# Altium schematic sheet WT2_Power.SchDoc
size A4
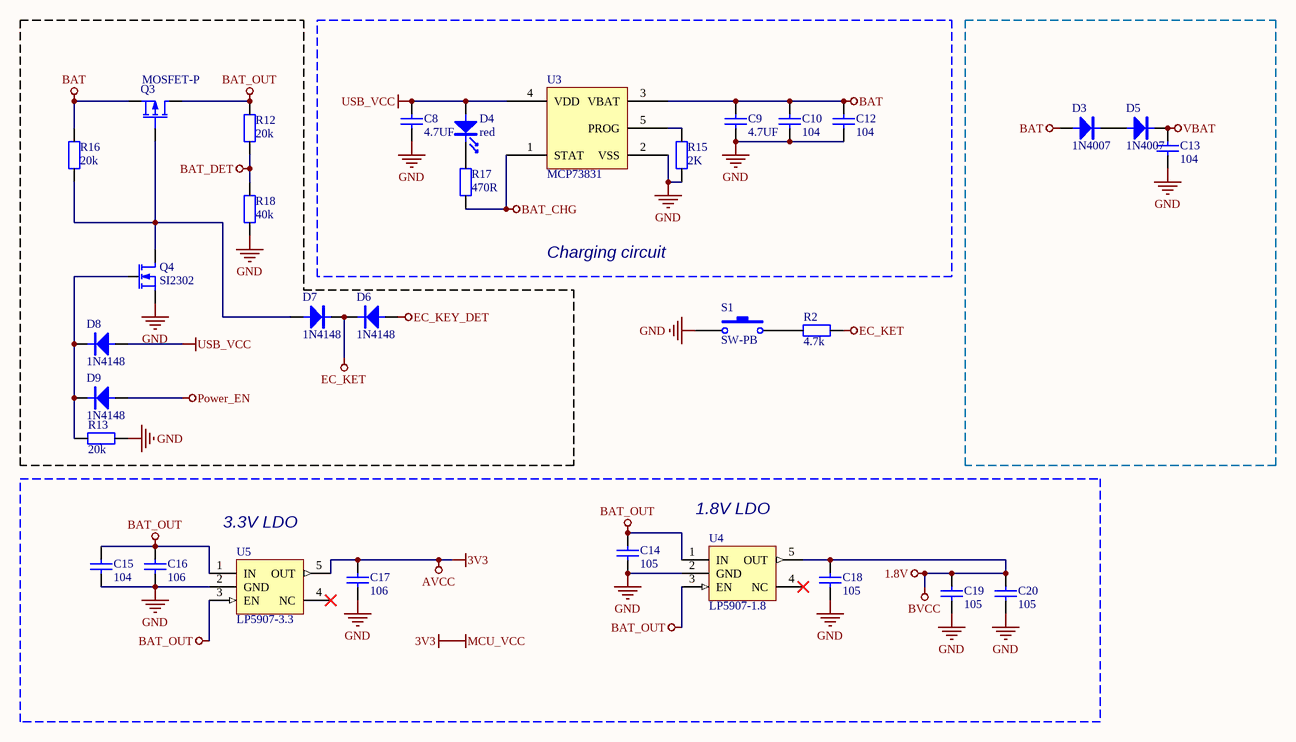
[diagram p0: WT2_Power.SchDoc]

## Parts
C8  4.7UF  [电容_C0805]
C9  4.7UF  [电容_C0805]
C10  104  [电容_C0402]
C12  104  [电容_C0402]
C13  104  [电容_C0402]
C14  105  [电容_C0402]
C15  104  [电容_C0402]
C16  106  [电容_C0603]
C17  106  [电容_C0603]
C18  105  [电容_C0402]
C19  105  [电容_C0402]
C20  105  [电容_C0402]
D3  1N4007  [二极管_SOD-323]
D4  red  [LED_0603]
D5  1N4007  [二极管_SOD-323]
D6  1N4148  [二极管_SOD-323]
D7  1N4148  [二极管_SOD-323]
D8  1N4148  [二极管_SOD-323]
D9  1N4148  [二极管_SOD-323]
Q3  MOSFET-P  [SOT23]
Q4  SI2302  [MOS_SOT-23]
R2  4.7k  [电阻_R0402]
R12  20k  [电阻_R0402]
R13  20k  [电阻_R0402]
R15  2K  [电阻_R0402]
R16  20k  [电阻_R0402]
R17  470R  [电阻_R0402]
R18  40k  [电阻_R0402]
S1  SW-PB  [KEY-TE26EA]
U3  MCP73831  [SOT23-5]
U4  LP5907-1.8  [SOT23-5]
U5  LP5907-3.3  [SOT23-5]

## Blocks framed on the sheet
Charging circuit: C8-C10 C12 D4 R15 R17 U3

## Nets
1.8V: C18.2 C19.2 C20.2 U4.5(OUT)  [also labelled BVCC]
3V3: C17.2 U5.5(OUT)  [also labelled AVCC, MCU_VCC]
BAT: C9.2 C10.1 C12.1 D3.A Q3.3(S) R16.2 U3.3(VBAT)
BAT_CHG: R17.1 U3.1(STAT)
BAT_DET: R12.1 R18.2
BAT_OUT: C14.2 C15.2 C16.2 Q3.2(D) R12.2 U4.1(IN) U4.3(EN) U5.1(IN) U5.3(EN)
EC_KET: D6.K D7.K R2.1
EC_KEY_DET: D6.A
GND: C8.1 C9.1 C10.2 C12.2 C13.2 C14.1 C15.1 C16.1 C17.1 C18.1 C19.1 C20.1 Q4.3(S) R13.1 R15.1 R18.1 S1.1 U3.2(VSS) U4.2(GND) U5.2(GND)
Power_EN: D9.A
USB_VCC: C8.2 D4.A D8.A U3.4(VDD)
VBAT: C13.1 D5.K
NetD3_K: D3.K D5.A
NetD4_K: D4.K R17.2
NetD7_A: D7.A Q3.1(G) Q4.2(D) R16.1
NetD8_K: D8.K D9.K Q4.1(G) R13.2
NetR2_2: R2.2 S1.2
NetR15_2: R15.2 U3.5(PROG)

Not connected (* = marked no-connect by the designer): U4 4(NC)*; U5 4(NC)*

## Notes on the sheet
- (near U5) 3.3V LDO
- (near U4) 1.8V LDO

## Library data of the parts
C8-C10 C12-C20 = cap: U: 50V; 参数: Cap,0805,X7R,104K,50V,125C,±10%
  C8 C9: C: 4.7UF
  C10 C12 C13 C15: C: 104
  C14 C18-C20: C: 105
  C16 C17: C: 106
D3 D5 = Diode: _Specification: Diode,1N4007,SOD-323,1A,40V; _Comma: ,; _Footprint: SOD-323; _Voltage: 40V; _Current: 1A; _Name: Diode; _Model: 1N4007
D4 = LED: 参数: LED,0603,Red
D6-D9 = Diode: _Specification: Diode,1N4148,SOD-323,1A,40V; _Comma: ,; _Footprint: SOD-323; _Voltage: 40V; _Current: 1A; _Name: Diode; _Model: 1N4148
Q3 = MOSFET-P: P-Channel MOSFET; Published: 8-Jun-2000; LatestRevisionDate: 17-Jul-2002; LatestRevisionNote: Re-released for DXP Platform.; PackageVersion: 1995/1996; PackageReference: E3; Publisher: Altium Limited; PackageDescription: TO, Flat Index; 3 In-Line, Axial Leads; Body Dia. 4.6mm; Lead Dia. 0.5 mm (max)
Q4 = MOSFET-N: _Comma: ,; _Current: 150A; _Footprint: DFN5*6; _Name: N-MOSFET; _Specification: N-MOSFET,SI2302,DFN5*6,150A,30V; _Voltage: 30V; _Model: SI2302
R2 R12 R13 R15-R18 = Res: P: 1/8W; 参数: Res,0805,0R,±1%,1/8W,100ppm,155C
  R2: R: 4.7k
  R12 R13 R16: R: 20k
  R15: R: 2K
  R17: R: 470R
  R18: R: 40k
S1 = SW-PB: 按键
U3 = MCP73831: 线性充电管理控制器
U4 U5 = LP5907: LDO